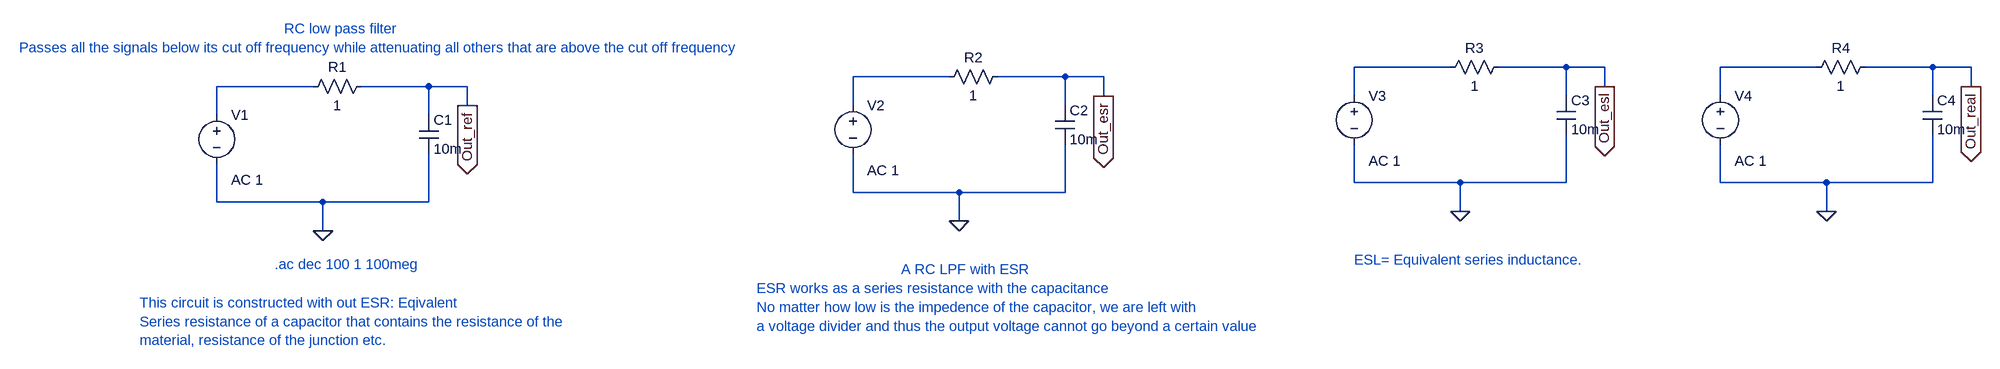
[diagram p0: schematic Capacitor.asc]
Capacitor.asc, the LTspice schematic file:
Version 4.1
SHEET 1 3000 1128
WIRE 2064 -96 1904 -96
WIRE 2256 -96 2144 -96
WIRE 2320 -96 2256 -96
WIRE 2672 -96 2512 -96
WIRE 2864 -96 2752 -96
WIRE 2928 -96 2864 -96
WIRE 1232 -80 1072 -80
WIRE 1424 -80 1312 -80
WIRE 1488 -80 1424 -80
WIRE 176 -64 16 -64
WIRE 368 -64 256 -64
WIRE 432 -64 368 -64
WIRE 2320 -64 2320 -96
WIRE 2928 -64 2928 -96
WIRE 1488 -48 1488 -80
WIRE 1904 -48 1904 -96
WIRE 2256 -48 2256 -96
WIRE 2512 -48 2512 -96
WIRE 2864 -48 2864 -96
WIRE 432 -32 432 -64
WIRE 1072 -32 1072 -80
WIRE 1424 -32 1424 -80
WIRE 16 -16 16 -64
WIRE 368 -16 368 -64
WIRE 1904 96 1904 32
WIRE 2080 96 1904 96
WIRE 2256 96 2256 16
WIRE 2256 96 2080 96
WIRE 2512 96 2512 32
WIRE 2688 96 2512 96
WIRE 2864 96 2864 16
WIRE 2864 96 2688 96
WIRE 1072 112 1072 48
WIRE 1248 112 1072 112
WIRE 1424 112 1424 32
WIRE 1424 112 1248 112
WIRE 16 128 16 64
WIRE 192 128 16 128
WIRE 368 128 368 48
WIRE 368 128 192 128
WIRE 2080 144 2080 96
WIRE 2688 144 2688 96
WIRE 1248 160 1248 112
WIRE 192 176 192 128
FLAG 192 176 0
FLAG 432 -32 Out_ref
IOPIN 432 -32 Out
FLAG 1248 160 0
FLAG 1488 -48 Out_esr
IOPIN 1488 -48 Out
FLAG 2080 144 0
FLAG 2320 -64 Out_esl
IOPIN 2320 -64 Out
FLAG 2688 144 0
FLAG 2928 -64 Out_real
IOPIN 2928 -64 Out
SYMBOL voltage 16 -32 R0
WINDOW 123 24 124 Left 2
WINDOW 39 0 0 Left 0
SYMATTR Value2 AC 1
SYMATTR InstName V1
SYMATTR Value ""
SYMBOL res 272 -80 R90
WINDOW 0 0 56 VBottom 2
WINDOW 3 32 56 VTop 2
SYMATTR InstName R1
SYMATTR Value 1
SYMBOL cap 352 -16 R0
SYMATTR InstName C1
SYMATTR Value 10m
SYMBOL voltage 1072 -48 R0
WINDOW 123 24 124 Left 2
WINDOW 39 0 0 Left 0
SYMATTR Value2 AC 1
SYMATTR InstName V2
SYMATTR Value ""
SYMBOL res 1328 -96 R90
WINDOW 0 0 56 VBottom 2
WINDOW 3 32 56 VTop 2
SYMATTR InstName R2
SYMATTR Value 1
SYMBOL cap 1408 -32 R0
SYMATTR InstName C2
SYMATTR Value 10m
SYMATTR SpiceLine Rser=265m
SYMBOL voltage 1904 -64 R0
WINDOW 123 24 124 Left 2
WINDOW 39 0 0 Left 0
SYMATTR Value2 AC 1
SYMATTR InstName V3
SYMATTR Value ""
SYMBOL res 2160 -112 R90
WINDOW 0 0 56 VBottom 2
WINDOW 3 32 56 VTop 2
SYMATTR InstName R3
SYMATTR Value 1
SYMBOL cap 2240 -48 R0
SYMATTR InstName C3
SYMATTR Value 10m
SYMATTR SpiceLine Lser=1u
SYMBOL voltage 2512 -64 R0
WINDOW 123 24 124 Left 2
WINDOW 39 0 0 Left 0
SYMATTR Value2 AC 1
SYMATTR InstName V4
SYMATTR Value ""
SYMBOL res 2768 -112 R90
WINDOW 0 0 56 VBottom 2
WINDOW 3 32 56 VTop 2
SYMATTR InstName R4
SYMATTR Value 1
SYMBOL cap 2848 -48 R0
SYMATTR InstName C4
SYMATTR Value 10m
SYMATTR SpiceLine Rser=265m Lser=10u
TEXT 112 232 Left 2 ;.ac dec 100 1 100meg
TEXT 128 -160 Left 2 ;RC low pass filter
TEXT -312 -128 Left 2 ;Passes all the signals below its cut off frequency while attenuating all others that are above the cut off frequency
TEXT -112 296 Left 2 ;This circuit is constructed with out ESR: Eqivalent\nSeries resistance of a capacitor that contains the resistance of the \nmaterial, resistance of the junction etc.
TEXT 1152 240 Left 2 ;A RC LPF with ESR
TEXT 912 272 Left 2 ;ESR works as a series resistance with the capacitance\nNo matter how low is the impedence of the capacitor, we are left with\na voltage divider and thus the output voltage cannot go beyond a certain value
TEXT 1904 224 Left 2 ;ESL= Equivalent series inductance.

The netlist it stands for:
* Capacitor.asc
V1 N004 0 AC 1
R1 Out_ref N004 1
C1 Out_ref 0 10m
V2 N003 0 AC 1
R2 Out_esr N003 1
C2 Out_esr 0 10m Rser=265m
V3 N001 0 AC 1
R3 Out_esl N001 1
C3 Out_esl 0 10m Lser=1u
V4 N002 0 AC 1
R4 Out_real N002 1
C4 Out_real 0 10m Rser=265m Lser=10u
* .ac dec 100 1 100meg
* RC low pass filter
* Passes all the signals below its cut off frequency while attenuating all others that are above the cut off frequency
* This circuit is constructed with out ESR: Eqivalent
* Series resistance of a capacitor that contains the resistance of the
* material, resistance of the junction etc.
* A RC LPF with ESR
* ESR works as a series resistance with the capacitance
* No matter how low is the impedence of the capacitor, we are left with
* a voltage divider and thus the output voltage cannot go beyond a certain value
* ESL= Equivalent series inductance.
.backanno
.end